# EAGLE design tutorial5 (EAGLE 9.6.2)
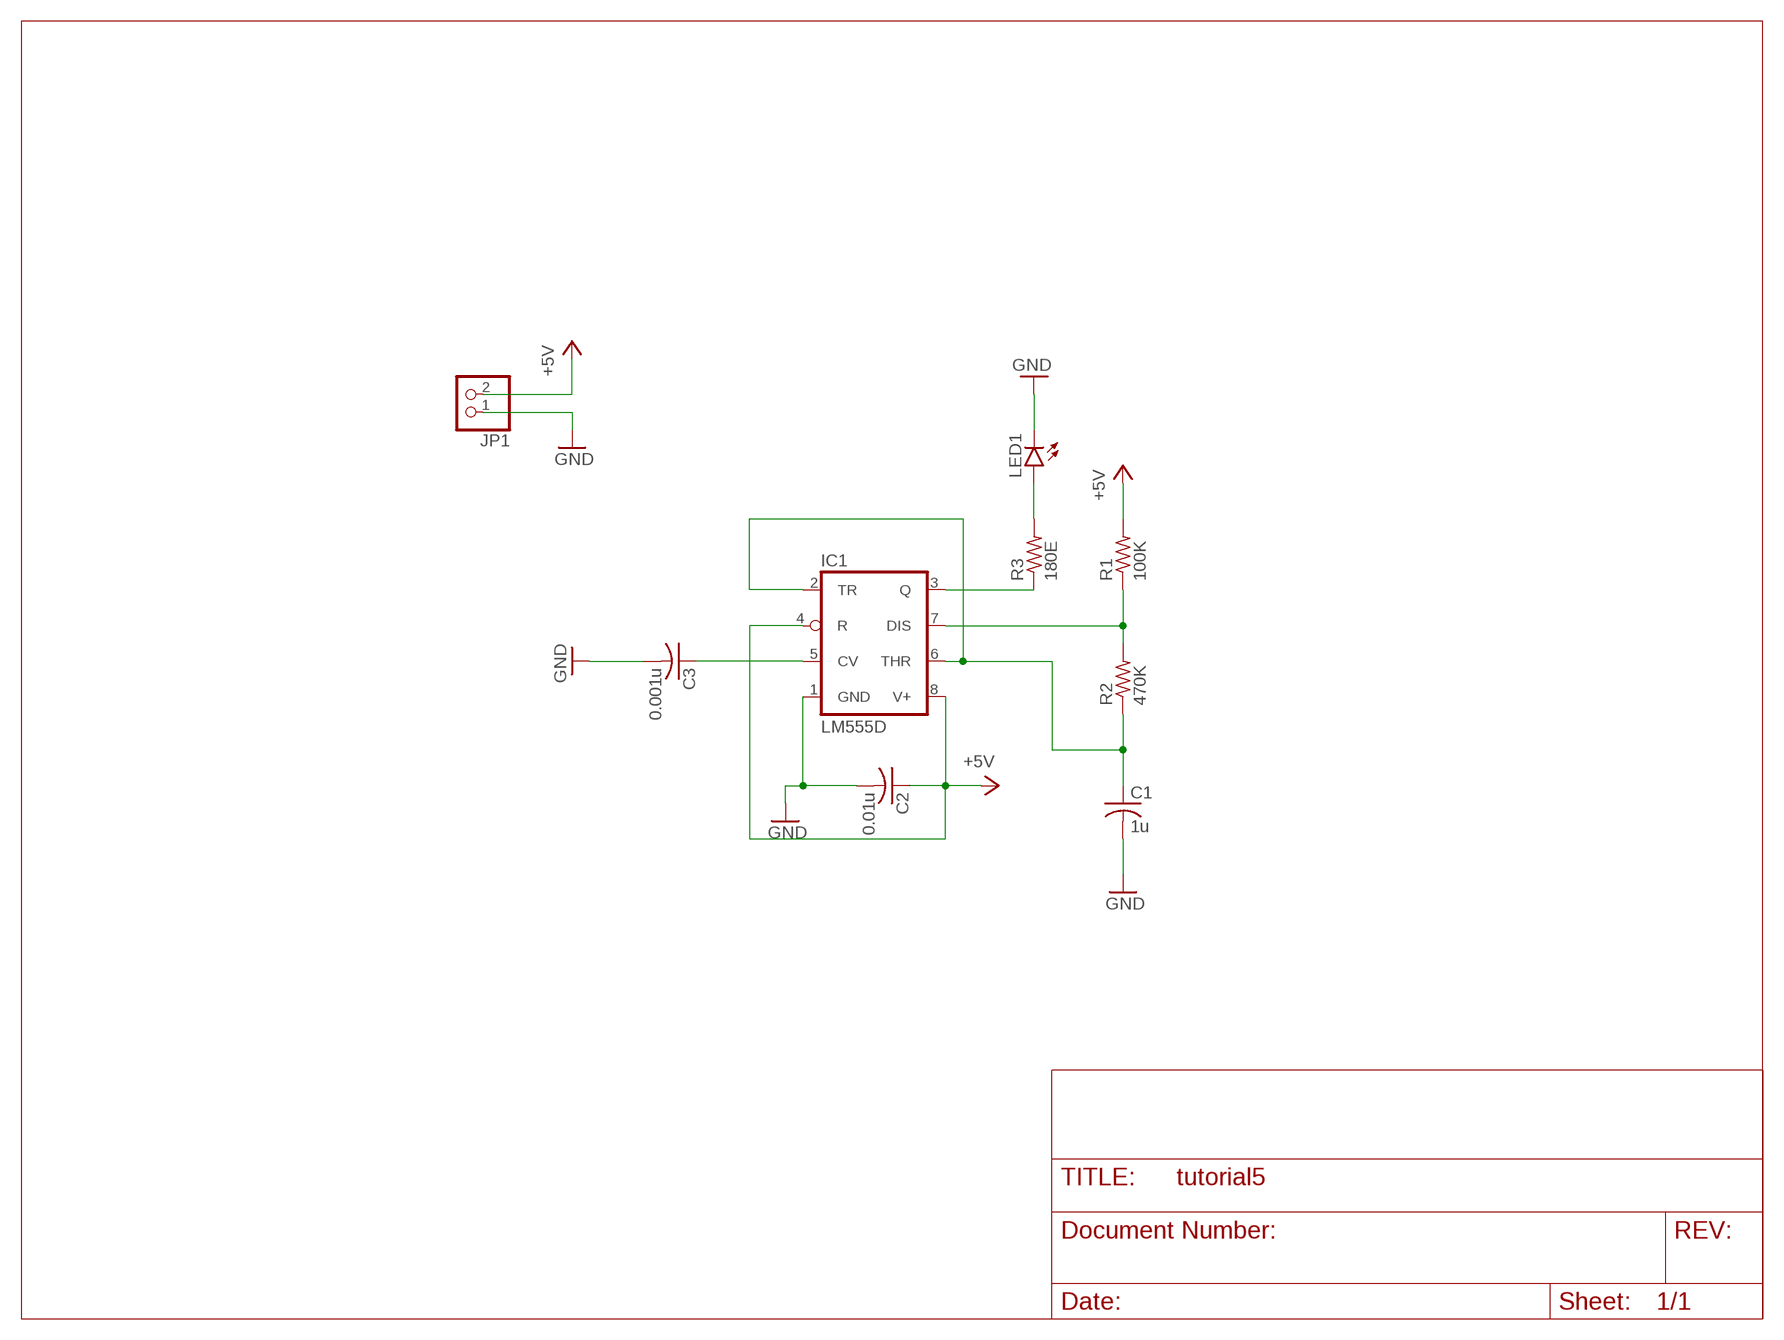
[diagram p0: schematic, sheet 1]

## Parts
C1  1u  C-USC0805  [C0805]
C2  0.01u  C-USC0805  [C0805]
C3  0.001u  C-USC0805  [C0805]
IC1  LM555D  [SO08]
JP1  PINHD-1X2  [1X02]
LED1  LED5MM  [LED5MM]
R1  100K  R-US_R0805  [R0805]
R2  470K  R-US_R0805  [R0805]
R3  180E  R-US_R0805  [R0805]

## Nets
+5V: C2.1 IC1.4(R) IC1.8(V+) JP1.2 R1.2
GND: C1.2 C2.2 C3.2 IC1.1(GND) JP1.1 LED1.K(C)
N$1: IC1.7(DIS) R1.1 R2.2
N$2: C1.1 IC1.2(TR) IC1.6(THR) R2.1
N$4: IC1.3(Q) R3.1
N$5: LED1.A R3.2
N$9: C3.1 IC1.5(CV)

## Library data of the parts
C1-C3 = rcl:C-US: CAPACITOR, American symbol; SPICEPREFIX: C
IC1 = linear:*555: TIMER
JP1 = pinhead:PINHD-1X2: PIN HEADER
LED1 = led:LED: LED OSRAM: - CHIPLED LG R971, LG N971, LY N971, LG Q971, LY Q971, LO R971, LY R971 LH N974, LH R974 LS Q976, LO Q976, LY Q976 LO Q996 - Hyper CHIPLED LW Q18S LB Q993, LB Q99A, LB R99A - SideLED LS A670, LO A670, LY A670, LG A670, LP A670 LB A673, LV A673, LT A673, LW A673 LH A674 LY A675 LS A676, LA A676, LO A676, LY A676, LW A676 LS A679, LY A679, LG A679 - Hyper Micro SIDELED® LS Y876, LA Y876, LO Y876, LY Y876 LT Y87S - SmartLED LW L88C, LW L88S LB L89C, LB L89S, LG L890 LS L89K, LO L89K, LY L89K LS L896, LA L896, LO L896, LY L896 - TOPLED LS T670, LO T670, LY T670, LG T670, LP T670 LSG T670, LSP T670, LSY T670, LOP T670, LYG T670 LG T671, LOG T671, LSG T671 LB T673, LV T673, LT T673, LW T673 LH T674 LS T676, LA T676, LO T676, LY T676, LB T676, LH T676, LSB T676, LW T676 LB T67C, LV T67C, LT T67C, LS T67K, LO T67K, LY T67K, LW E67C LS E67B, LA E67B, LO E67B, LY E67B, LB E67C, LV E67C, LT E67C LW T67C LS T679, LY T679, LG T679 LS T770, LO T770, LY T770, LG T770, LP T770 LB T773, LV T773, LT T773, LW T773 LH T774 LS E675, LA E675, LY E675, LS T675 LS T776, LA T776, LO T776, LY T776, LB T776 LHGB T686 LT T68C, LB T68C - Hyper Mini TOPLED® LB M676 - Mini TOPLED Santana® LG M470 LS M47K, LO M47K, LY M47K Source: http://www.osram.convergy.de LUXEON: - LUMILED® LXK2-PW12-R00, LXK2-PW12-S00, LXK2-PW14-U00, LXK2-PW14-V00 LXK2-PM12-R00, LXK2-PM12-S00, LXK2-PM14-U00 LXK2-PE12-Q00, LXK2-PE12-R00, LXK2-PE12-S00, LXK2-PE14-T00, LXK2-PE14-U00 LXK2-PB12-K00, LXK2-PB12-L00, LXK2-PB12-M00, LXK2-PB14-N00, LXK2-PB14-P00, LXK2-PB14-Q00 LXK2-PR12-L00, LXK2-PR12-M00, LXK2-PR14-Q00, LXK2-PR14-R00 LXK2-PD12-Q00, LXK2-PD12-R00, LXK2-PD12-S00 LXK2-PH12-R00, LXK2-PH12-S00 LXK2-PL12-P00, LXK2-PL12-Q00, LXK2-PL12-R00 Source: www.luxeon.com KINGBRIGHT: KA-3528ASYC Source: www.kingbright.com
R1-R3 = rcl:R-US_: RESISTOR, American symbol; SPICEPREFIX: R

## Board
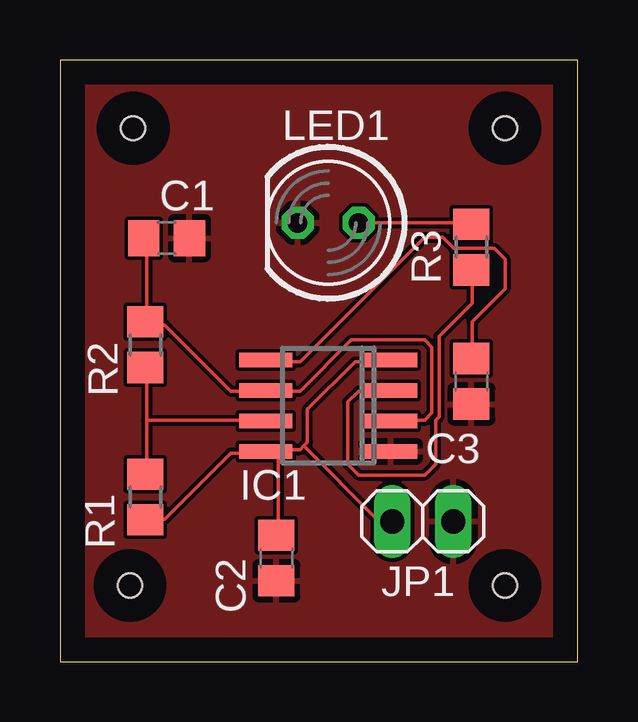
[diagram p1: board, top side]

Size 21.57 x 25.07 mm. Coordinates in mm from the lower left corner, seen from the top.
Outline: 0,0 21.57,0 21.57,25.07 0,25.07 0,0
Copper layers (1*16): Top 0.035mm / dielectric 1.5mm / Bottom 0.035mm
Design rules "default": minimum track width 6mil, minimum drill 0.35mm, track to track 6mil, track to pad 6mil, pad to pad 6mil, via to via 6mil, smd to smd 6mil, copper to edge 40mil, drill to drill 6mil, minimum pad ring 10mil, minimum via ring 8mil, stop-mask expansion 4mil, vias tented up to drill 0mil, thermal gap 10mil
Holes 1 mm at 3.05,22.23 18.54,22.23 2.92,3.17 18.54,3.17

### Footprints (pad centres in the part's own frame; a part is rotated, then mirrored left to right if it is on the bottom)
C0805 = smd 1.3 x 1.5: 1 -0.95,0; 2 0.95,0
SO08 = smd 0.6 x 2.2: 1 -1.905,-2.6; 2 -0.635,-2.6; 3 0.635,-2.6; 4 1.905,-2.6; 5 1.905,2.6; 6 0.635,2.6; 7 -0.635,2.6; 8 -1.905,2.6
1X02 = drill 1.016 long: 1 -1.27,0; 2 1.27,0
LED5MM = drill 0.813 octagon: A -1.27,0; K 1.27,0
R0805 = smd 1.3 x 1.5: 1 -0.95,0; 2 0.95,0

### Placement (x,y rotation side)
C1  4.45,17.65 0 top
C2  9.02,4.32 270 top
C3  17.14,11.68 270 top
IC1  11.18,10.67 90 top
JP1  15.11,5.84 180 top
LED1  11.18,18.29 180 top
R1  3.56,6.86 270 top
R2  3.56,13.21 270 top
R3  17.14,17.27 90 top

### Tracks (layer width: path | path; a pad name or v marks a point on that pad's centre or on a via)
+5V
  Top 0.152: 9.09,8.53 9.09,5.33 C2.1 | 9.09,8.53 8.94,8.69 8.64,8.69 IC1.8 | R1.2 3.61,5.94 4.37,5.94 7.11,8.69 8.48,8.69 IC1.8 | 10.16,8.99 10.01,8.84 9.4,8.84 9.09,8.53 | 10.16,8.99 10.31,9.14 10.31,10.52 12.29,12.5 13.67,12.5 IC1.4 | 9.09,8.53 IC1.8 | 10.16,8.99 13.21,5.94 13.82,5.94 JP1.2
GND
  pour Top: 0,25.02 0,0 21.59,0 21.59,25.02
N$1
  Top 0.152: 3.61,10.06 3.61,12.19 R2.2 | 3.61,10.06 3.61,7.92 R1.1 | 3.61,10.06 8.48,10.06 IC1.7
N$2
  Top 0.152: C1.1 3.61,17.53 3.61,14.17 R2.1 3.61,14.02 4.37,14.02 7.11,11.28 8.48,11.28 IC1.6 8.64,11.28 10.01,11.28 12.14,13.41 15.19,13.41 15.49,13.11 15.49,10.36 15.19,10.06 13.82,10.06 IC1.2
N$4
  Top 0.152: R3.1 17.17,16.31 17.17,14.94 15.8,13.56 15.8,10.21 15.65,10.06 15.65,8.23 15.19,7.77 12.45,7.77 11.99,8.23 11.99,10.82 12.45,11.28 13.67,11.28 IC1.3
N$5
  Top 0.152: LED1.A 17.02,18.29 R3.2
N$9
  Top 0.152: C3.1 17.17,12.65 17.17,14.17 18.54,15.54 18.54,16.76 18.09,17.22 16.41,17.22 15.95,17.68 15.19,17.68 10.01,12.5 8.64,12.5 IC1.5